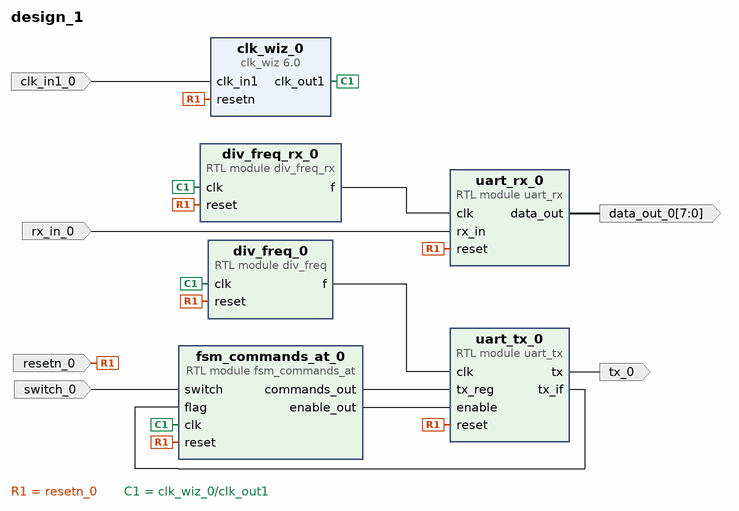
[diagram p0: block diagram of the top level]
# Vivado block design design_1, xc7z010clg400-1, Vivado 2019.1
create_bd_design design_1

create_bd_port -dir I -type clk clk_in1_0
set_property -dict {CONFIG.FREQ_HZ 33333300} [get_bd_ports clk_in1_0]
create_bd_port -dir I -type rst resetn_0
create_bd_port -dir I switch_0
create_bd_port -dir O tx_0
create_bd_port -dir I rx_in_0
create_bd_port -dir O -from 7 -to 0 data_out_0

create_bd_cell -type ip -vlnv xilinx.com:ip:clk_wiz:6.0 clk_wiz_0
set_property -dict [list \
  CONFIG.CLKIN1_JITTER_PS 300.0 \
  CONFIG.CLKOUT1_JITTER 241.121 \
  CONFIG.CLKOUT1_PHASE_ERROR 204.117 \
  CONFIG.CLKOUT1_REQUESTED_OUT_FREQ 50.000 \
  CONFIG.MMCM_CLKFBOUT_MULT_F 30.000 \
  CONFIG.MMCM_CLKIN1_PERIOD 30.000 \
  CONFIG.MMCM_CLKIN2_PERIOD 10.0 \
  CONFIG.MMCM_CLKOUT0_DIVIDE_F 20.000 \
  CONFIG.OVERRIDE_MMCM false \
  CONFIG.PRIM_IN_FREQ 33.3333 \
  CONFIG.RESET_PORT resetn \
  CONFIG.RESET_TYPE ACTIVE_LOW \
  CONFIG.USE_LOCKED false \
] [get_bd_cells clk_wiz_0]
create_bd_cell -type module -reference uart_tx uart_tx_0
create_bd_cell -type module -reference div_freq div_freq_0
create_bd_cell -type module -reference div_freq_rx div_freq_rx_0
create_bd_cell -type module -reference uart_rx uart_rx_0
create_bd_cell -type module -reference fsm_commands_at fsm_commands_at_0

# ---- connections ----

connect_bd_net -net resetn_0_1 [get_bd_ports resetn_0] \
  [get_bd_pins clk_wiz_0/resetn] [get_bd_pins uart_tx_0/reset] [get_bd_pins div_freq_0/reset] \
  [get_bd_pins div_freq_rx_0/reset] [get_bd_pins uart_rx_0/reset] [get_bd_pins fsm_commands_at_0/reset]
connect_bd_net -net clk_in1_0_1 [get_bd_ports clk_in1_0] [get_bd_pins clk_wiz_0/clk_in1]
connect_bd_net [get_bd_pins clk_wiz_0/clk_out1] [get_bd_pins div_freq_0/clk] [get_bd_pins div_freq_rx_0/clk] [get_bd_pins fsm_commands_at_0/clk]
connect_bd_net [get_bd_pins fsm_commands_at_0/commands_out] [get_bd_pins uart_tx_0/tx_reg]
connect_bd_net [get_bd_pins fsm_commands_at_0/enable_out] [get_bd_pins uart_tx_0/enable]
connect_bd_net [get_bd_pins div_freq_0/f] [get_bd_pins uart_tx_0/clk]
connect_bd_net -net switch_0_1 [get_bd_ports switch_0] [get_bd_pins fsm_commands_at_0/switch]
connect_bd_net [get_bd_pins uart_tx_0/tx_if] [get_bd_pins fsm_commands_at_0/flag]
connect_bd_net [get_bd_pins uart_tx_0/tx] [get_bd_ports tx_0]
connect_bd_net [get_bd_pins div_freq_rx_0/f] [get_bd_pins uart_rx_0/clk]
connect_bd_net -net rx_in_0_1 [get_bd_ports rx_in_0] [get_bd_pins uart_rx_0/rx_in]
connect_bd_net [get_bd_pins uart_rx_0/data_out] [get_bd_ports data_out_0]

validate_bd_design
save_bd_design
